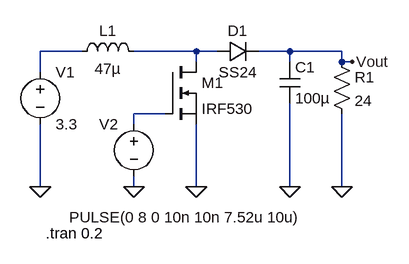
[diagram p0: schematic lista7_zad4.asc]
lista7_zad4.asc, the LTspice schematic file:
Version 4.1
SHEET 1 880 680
WIRE 176 112 112 112
WIRE 352 112 256 112
WIRE 384 112 352 112
WIRE 496 112 448 112
WIRE 576 112 496 112
WIRE 352 128 352 112
WIRE 496 128 496 112
WIRE 576 128 576 112
WIRE 592 128 576 128
WIRE 112 144 112 112
WIRE 304 208 256 208
WIRE 256 224 256 208
WIRE 112 320 112 224
WIRE 256 320 256 304
WIRE 352 320 352 224
WIRE 496 320 496 192
WIRE 576 320 576 208
FLAG 112 320 0
FLAG 352 320 0
FLAG 496 320 0
FLAG 576 320 0
FLAG 256 320 0
FLAG 592 128 Vout
SYMBOL voltage 112 128 R0
WINDOW 123 0 0 Left 0
WINDOW 39 0 0 Left 0
SYMATTR InstName V1
SYMATTR Value 3.3
SYMBOL ind 160 128 R270
WINDOW 0 32 56 VTop 2
WINDOW 3 5 56 VBottom 2
SYMATTR InstName L1
SYMATTR Value 47µ
SYMBOL nmos 304 128 R0
SYMATTR InstName M1
SYMATTR Value IRF530
SYMBOL diode 384 128 R270
WINDOW 0 32 32 VTop 2
WINDOW 3 0 32 VBottom 2
SYMATTR InstName D1
SYMATTR Value SS24
SYMATTR Description Diode
SYMATTR Type diode
SYMBOL cap 480 128 R0
SYMATTR InstName C1
SYMATTR Value 100µ
SYMBOL res 560 112 R0
SYMATTR InstName R1
SYMATTR Value 24
SYMBOL voltage 256 208 M0
WINDOW 3 -258 159 Left 2
WINDOW 123 0 0 Left 0
WINDOW 39 0 0 Left 0
SYMATTR InstName V2
SYMATTR Value PULSE(0 8 0 10n 10n 7.52u 10u)
TEXT 120 392 Left 2 !.tran 0.2

The netlist it stands for:
* lista7_zad4.asc
V1 N001 0 3.3
L1 N001 N002 47µ
M1 N002 N003 0 0 IRF530
D1 N002 Vout SS24
C1 Vout 0 100µ
R1 Vout 0 24
V2 N003 0 PULSE(0 8 0 10n 10n 7.52u 10u)
.model D D
.lib standard.dio
.model NMOS NMOS
.model PMOS PMOS
.lib standard.mos
.tran 0.2
.backanno
.end